# Altium schematic sheet Power3.SchDoc
size A
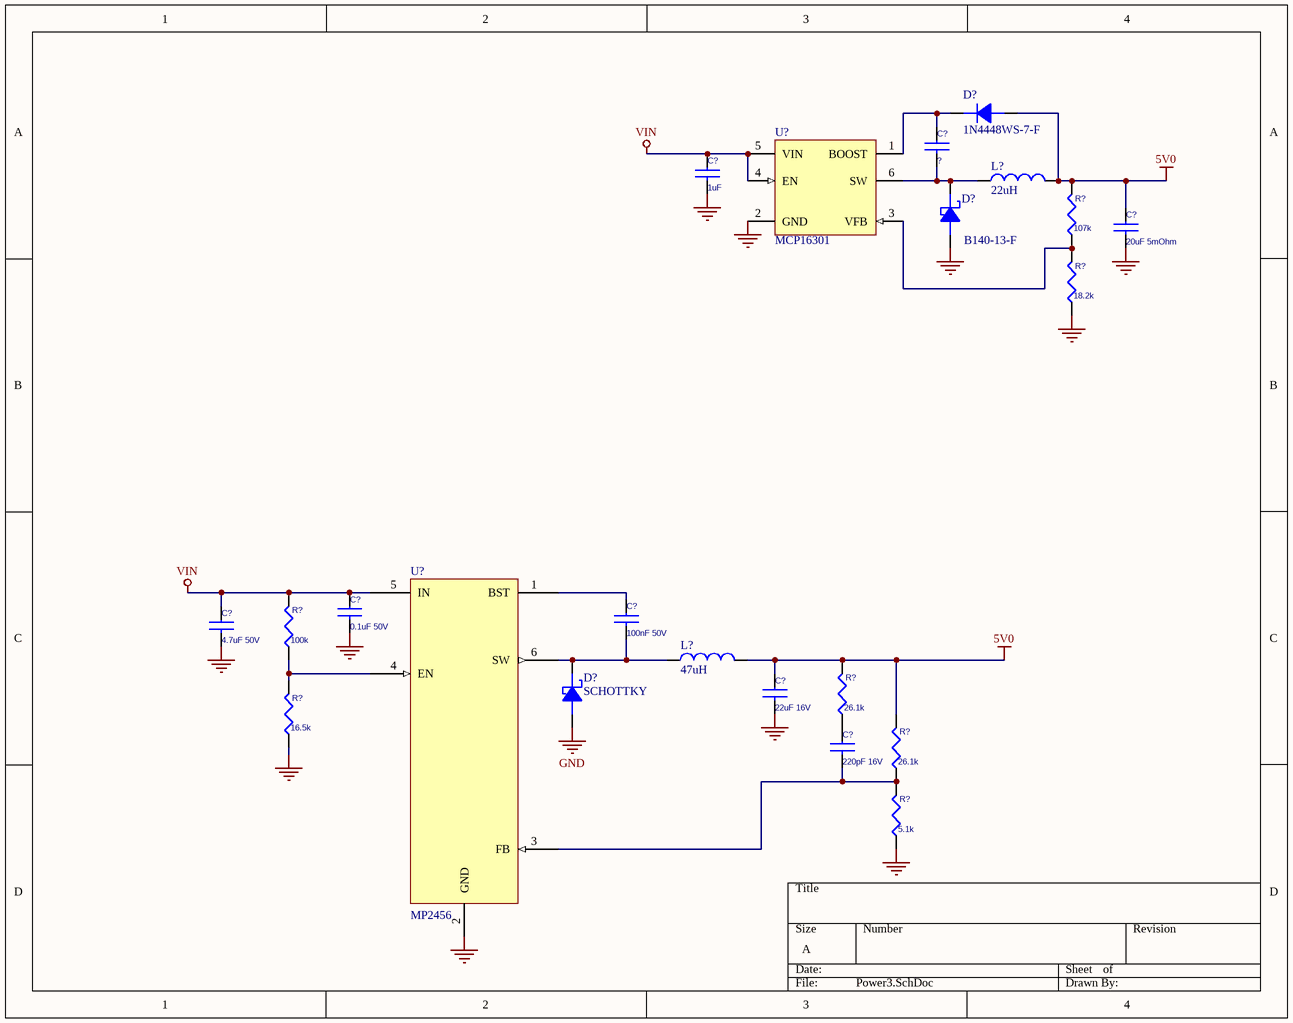
[diagram p0: Power3.SchDoc]

## Parts
(Parts that share a designator on the sheet are numbered #1, #2 ... from top to bottom, then left to right.)
C?#1  ?
C?#2  1uF
C?#3  20uF 5mOhm
C?#4  0.1uF 50V
C?#5  100nF 50V
C?#6  4.7uF 50V
C?#7  22uF 16V
C?#8  220pF 16V
D?#1  1N4448WS-7-F  [1N4448WS-7-F]
D?#2  B140-13-F  [DO-214AC SMA]
D?#3  SCHOTTKY
L?#1  22uH
L?#2  47uH  [IND_TAIYO_NR6028]
R?#1  107k  [RESC1608N]
R?#2  18.2k  [RESC1608N]
R?#3  100k  [RESC1608N]
R?#4  26.1k  [RESC1608N]
R?#5  16.5k  [RESC1608N]
R?#6  26.1k  [RESC1608N]
R?#7  5.1k  [RESC1608N]
U?#1  MCP16301  [MCP16301]
U?#2  MP2456  [MP2456]

## Nets
5V0: C?#3.1 C?#7.1 D?#1.A L?#1.2 L?#2.2 R?#1.2 R?#4.2 R?#6.2
GND: C?#2.2 C?#3.2 C?#4.2 C?#6.2 C?#7.2 D?#2.A D?#3.A R?#2.1 R?#5.1 R?#7.1 U?#1.2(GND)
VIN: C?#2.1 C?#4.1 C?#6.1 R?#3.2 U?#1.4(EN) U?#1.5(VIN) U?#2.5(IN)
NetC?#1_1: C?#1.1 D?#1.K U?#1.1(BOOST)
NetC?#1_2: C?#1.2 D?#2.K L?#1.1 U?#1.6(SW)
NetC?#5_1: C?#5.1 U?#2.1(BST)
NetC?#5_2: C?#5.2 D?#3.K L?#2.1 U?#2.6(SW)
NetC?#8_1: C?#8.1 R?#4.1
NetC?#8_2: C?#8.2 R?#6.1 R?#7.2 U?#2.3(FB)
NetR?#1_1: R?#1.1 R?#2.2 U?#1.3(VFB)
NetR?#3_1: R?#3.1 R?#5.2 U?#2.4(EN)

Not connected (* = marked no-connect by the designer): U?#2 2(GND)

## Notes on the sheet
- Labels drawn without touching a wire or pin: GND

## Library data of the parts
C?#1-C?#8 = CAP NP: Capacitor Ceramic *%
D?#1 = 1N4448WS-7-F: DIODE GEN PURP 75V 250MA SOD323
D?#2 = B140-13-F: DIODE SCHOTTKY 40V 1A SMA
D?#3 = DIODE SCHOTTKY
L?#1 = Inductor: 145mOhm; Supplier 1: Digi-Key; Supplier Part Number 1: SRN5040-220MCT-ND
L?#2 = Inductor: FIXED IND 47UH 920MA 390 MOHM; Supplier 1: Digi-Key; Supplier Part Number 1: 587-2099-6-ND
R?#1-R?#7 = RES: Resistor 1%
U?#1 = MCHP-MCP16301-SOT-23-6: IC REG BUCK ADJ 0.6A SOT23-6
U?#2 = MP2456: 0.5A, 50V, 1.2MHz   Step-Down Converter  TSOT23-6; Supplier 1: Digi-Key; Supplier Part Number 1: 1589-1120-1-ND